# EAGLE schematic RatDistortion (EAGLE 9.6.2)
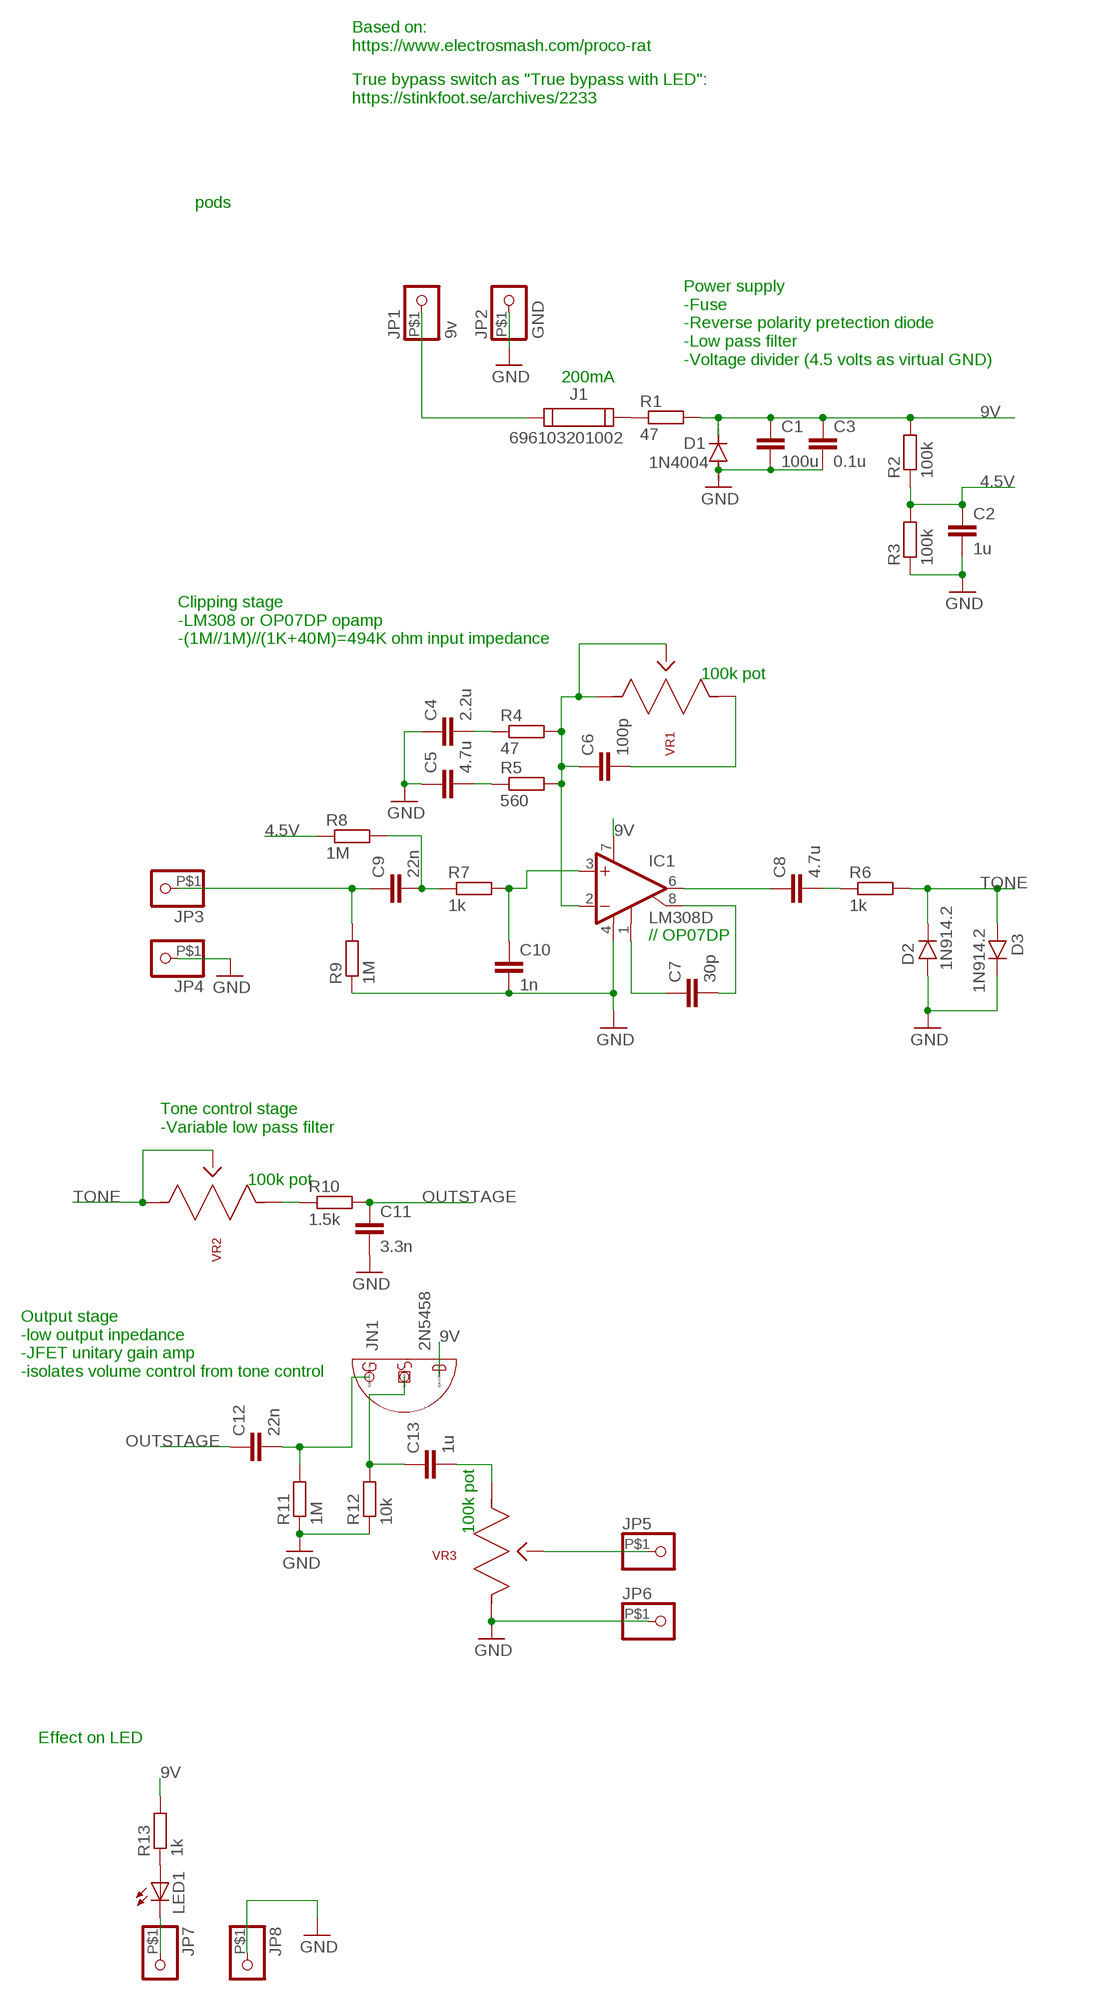
[diagram p0: schematic, sheet 1]

## Parts
C1  100u  C-EUC1206  [C1206]
C2  1u  C-EUC1206  [C1206]
C3  0.1u  C-EUC0603  [C0603]
C4  2.2u  C-EUC1206  [C1206]
C5  4.7u  C-EUC1206  [C1206]
C6  100p  C-EUC0603  [C0603]
C7  30p  C-EUC0603  [C0603]
C8  4.7u  C-EUC1206  [C1206]
C9  22n  C-EUC0603  [C0603]
C10  1n  C-EUC0603  [C0603]
C11  3.3n  C-EUC0603  [C0603]
C12  22n  C-EUC0603  [C0603]
C13  1u  C-EUC1206  [C1206]
D1  1N4004  [DO41-10]
D2  1N914.2  [DO35-2]
D3  1N914.2  [DO35-2]
IC1  LM308D  [SO08]
J1  696103201002  [696103201002]
JN1  2N5458  [TO92]
JP1  9v  PINHD-1X1-BIGPOGO  [1X1-BIGPOGO]
JP2  GND  PINHD-1X1-BIGPOGO  [1X1-BIGPOGO]
JP3  PINHD-1X1-BIGPOGO  [1X1-BIGPOGO]
JP4  PINHD-1X1-BIGPOGO  [1X1-BIGPOGO]
JP5  PINHD-1X1-BIGPOGO  [1X1-BIGPOGO]
JP6  PINHD-1X1-BIGPOGO  [1X1-BIGPOGO]
JP7  PINHD-1X1-BIGPOGO  [1X1-BIGPOGO]
JP8  PINHD-1X1-BIGPOGO  [1X1-BIGPOGO]
LED1  LED3MM  [LED3MM]
R1  47  R-EU_R0603  [R0603]
R2  100k  R-EU_R0603  [R0603]
R3  100k  R-EU_R0603  [R0603]
R4  47  R-EU_R0603  [R0603]
R5  560  R-EU_R0603  [R0603]
R6  1k  R-EU_R0603  [R0603]
R7  1k  R-EU_R0603  [R0603]
R8  1M  R-EU_R0603  [R0603]
R9  1M  R-EU_R0603  [R0603]
R10  1.5k  R-EU_R0603  [R0603]
R11  1M  R-EU_R0603  [R0603]
R12  10k  R-EU_R0603  [R0603]
R13  1k  R-EU_R0603  [R0603]
VR1  PTV09A-4225F-B104  [PTV09]
VR2  PTV09A-4225F-B104  [PTV09]
VR3  PTV09A-4225F-B104  [PTV09]

## Nets
4.5V: C2.1 R2.1 R3.2 R8.1
9V: C1.1 C3.1 D1.C IC1.7(V+) JN1.3(D) R1.2 R2.2 R13.2
GND: C1.2 C2.2 C3.2 C4.1 C5.1 C10.2 C11.2 D1.A D2.A D3.C IC1.4(V-) JP2.P$1 JP4.P$1 JP6.P$1 JP8.P$1 R3.1 R9.1 R11.1 R12.1 VR3.1
N$1: J1.2 R1.1
N$2: J1.1 JP1.P$1
N$3: C4.2 R4.1
N$4: C5.2 R5.1
N$5: C6.1 IC1.2(-IN) R4.2 R5.2 VR1.2 VR1.3
N$6: C6.2 VR1.1
N$7: C8.2 R6.1
N$8: C12.2 JN1.1(G) R11.2
N$9: C7.1 IC1.1(CMP1)
N$10: C7.2 IC1.8(CMP2)
N$11: C8.1 IC1.6(OUT)
N$12: C10.1 IC1.3(+IN) R7.2
N$13: C9.2 R7.1 R8.2
N$14: C9.1 JP3.P$1 R9.2
N$16: R10.1 VR2.1
N$17: C13.1 JN1.2(S) R12.2
N$18: C13.2 VR3.3
N$19: LED1.A R13.1
N$20: JP5.P$1 VR3.2
N$21: JP7.P$1 LED1.K(C)
OUTSTAGE: C11.1 C12.1 R10.2
TONE: D2.C D3.A R6.2 VR2.2 VR2.3

## Notes on the sheet
- Based on:
  https://www.electrosmash.com/proco-rat
- True bypass switch as "True bypass with LED":
  https://stinkfoot.se/archives/2233
- pods
- Power supply
  -Fuse
  -Reverse polarity pretection diode
  -Low pass filter
  -Voltage divider (4.5 volts as virtual GND)
- 200mA
- Clipping stage
  -LM308 or OP07DP opamp
  -(1M//1M)//(1K+40M)=494K ohm input impedance
- 100k pot
- // OP07DP
- Tone control stage
  -Variable low pass filter
- 100k pot
- Output stage
  -low output inpedance
  -JFET unitary gain amp
  -isolates volume control from tone control
- 100k pot
- Effect on LED

## Library data of the parts
C1-C13 = rcl:C-EU: CAPACITOR, European symbol; SPICEPREFIX: C
D1 = diode:1N4004: DIODE general purpose rectifier, 1 A
D2 D3 = 1N914:1N914: Fast Switching Diode DO-35 glass case a.k.a. 1N4148 Check prices <https://pricing.snapeda.com/parts/1N914/ON%20Semiconductor/view-part?ref=eda>; AVAILABILITY: In Stock; DESCRIPTION: Diode Standard 75V 200mA Surface Mount SOD-523F; MF: ON Semiconductor; MP: 1N914; PACKAGE: AXIAL LEAD-2 ON Semiconductor; PRICE: None; PURCHASE-URL: https://pricing.snapeda.com/search/part/1N914/?ref=eda
IC1 = linear:LM308: OP AMP
J1 = 696103201002:696103201002: WR-FSH Fuseholder THR Blocks PCB Clip Cover MATERIAL PROPERTIES Insulator Material PETG35 Insulator Flammability Rating UL94 V-0 Insulator Color Black Contact Material Copper Alloy Contact Plating Tin over Nickel Contact Type Stamped GENERAL INFORMATION Operating Temperature -30 up to +120 °C Compliance RoHS ELECTRICAL PROPERTIES IR UL 20 A IR VDE 10 A Working Voltage [UL] 250 V (AC) Working Voltage [VDE] 250 V (AC) Withstanding Voltage [UL] 1500 V (AC) Withstanding Voltage [VDE] 1500 V (AC) Contact Resistance 10 mΩ Contact Resistance [VDE] 10 mΩ MECHANICAL PROPERTIES Protection Class I & II Fuse Size 5x20 mm CERTIFICATION cULus Approval E157417 VDE Approval 120170 PACKAGING PROPERTIES Packaging Box <https://katalog.we-online.com/media/images/v2/o58927v209%20Family_p748_WR-FUSE_6961032010xx_4C.jpg> Details see: https://katalog.we-online.com/en/em/FSH_THR_PCB_CLIP_COVER_696103201002 Updated by Ella Wu 2019-10-25 2019 (C) Wurth Elektronik Check prices <https://pricing.snapeda.com/parts/696103201002/Wurth%20Electronics/view-part?ref=eda>; AVAILABILITY: In Stock; DESCRIPTION: Fuse Block 20 A 250V 1 Circuit Cartridge Through Hole; MF: Wurth Electronics; MP: 696103201002; PACKAGE: None; PRICE: None; PURCHASE-URL: https://pricing.snapeda.com/search/part/696103201002/?ref=eda
JN1 = 2N5458:2N5458: TO-92 Check prices <https://pricing.snapeda.com/parts/2N5458/ON%20Semiconductor/view-part?ref=eda>; AVAILABILITY: In Stock; DESCRIPTION: JFET N-Channel 25 V 310 mW Through Hole TO-92 (TO-226); MF: ON Semiconductor; MP: 2N5458; PACKAGE: E-PKG AXIAL-LEADED-2 ON Semiconductor; PRICE: None
JP1-JP8 = adafruit:PINHD-1X1: Pin header 1x1 for 0.1" spacing With round pins
LED1 = adafruit:LED: LED OSRAM: - CHIPLED LG R971, LG N971, LY N971, LG Q971, LY Q971, LO R971, LY R971 LH N974, LH R974 LS Q976, LO Q976, LY Q976 LO Q996 - Hyper CHIPLED LW Q18S LB Q993, LB Q99A, LB R99A - SideLED LS A670, LO A670, LY A670, LG A670, LP A670 LB A673, LV A673, LT A673, LW A673 LH A674 LY A675 LS A676, LA A676, LO A676, LY A676, LW A676 LS A679, LY A679, LG A679 - Hyper Micro SIDELED® LS Y876, LA Y876, LO Y876, LY Y876 LT Y87S - SmartLED LW L88C, LW L88S LB L89C, LB L89S, LG L890 LS L89K, LO L89K, LY L89K LS L896, LA L896, LO L896, LY L896 - TOPLED LS T670, LO T670, LY T670, LG T670, LP T670 LSG T670, LSP T670, LSY T670, LOP T670, LYG T670 LG T671, LOG T671, LSG T671 LB T673, LV T673, LT T673, LW T673 LH T674 LS T676, LA T676, LO T676, LY T676, LB T676, LH T676, LSB T676, LW T676 LB T67C, LV T67C, LT T67C, LS T67K, LO T67K, LY T67K, LW E67C LS E67B, LA E67B, LO E67B, LY E67B, LB E67C, LV E67C, LT E67C LW T67C LS T679, LY T679, LG T679 LS T770, LO T770, LY T770, LG T770, LP T770 LB T773, LV T773, LT T773, LW T773 LH T774 LS E675, LA E675, LY E675, LS T675 LS T776, LA T776, LO T776, LY T776, LB T776 LHGB T686 LT T68C, LB T68C - Hyper Mini TOPLED® LB M676 - Mini TOPLED Santana® LG M470 LS M47K, LO M47K, LY M47K Source: http://www.osram.convergy.de/
R1-R13 = rcl:R-EU_: RESISTOR, European symbol; SPICEPREFIX: R
VR1-VR3 = PTV09A-4225F-B104:PTV09A-4225F-B104: 100k Ohm 1 Gang Linear Through Hole, Snap In Potentiometer Detent 1 Turn Carbon 0.05W, 1/20W PC Pins, Board Locks (NOT RA) Check prices <https://pricing.snapeda.com/parts/PTV09A-4225F-B104/Bourns/view-part?ref=eda>; AVAILABILITY: In Stock; DESCRIPTION: 100k Ohm 1 Gang Linear Through Hole, Snap In Potentiometer Detent 1.0 Kierros Carbon 0.05W, 1/20W PC Pins, Board Locks; MF: Bourns; MP: PTV09A-4225F-B104; PACKAGE: None; PRICE: None; PURCHASE-URL: https://pricing.snapeda.com/search/part/PTV09A-4225F-B104/?ref=eda